# EasyEDA schematic ET_Sch_ver_1.json
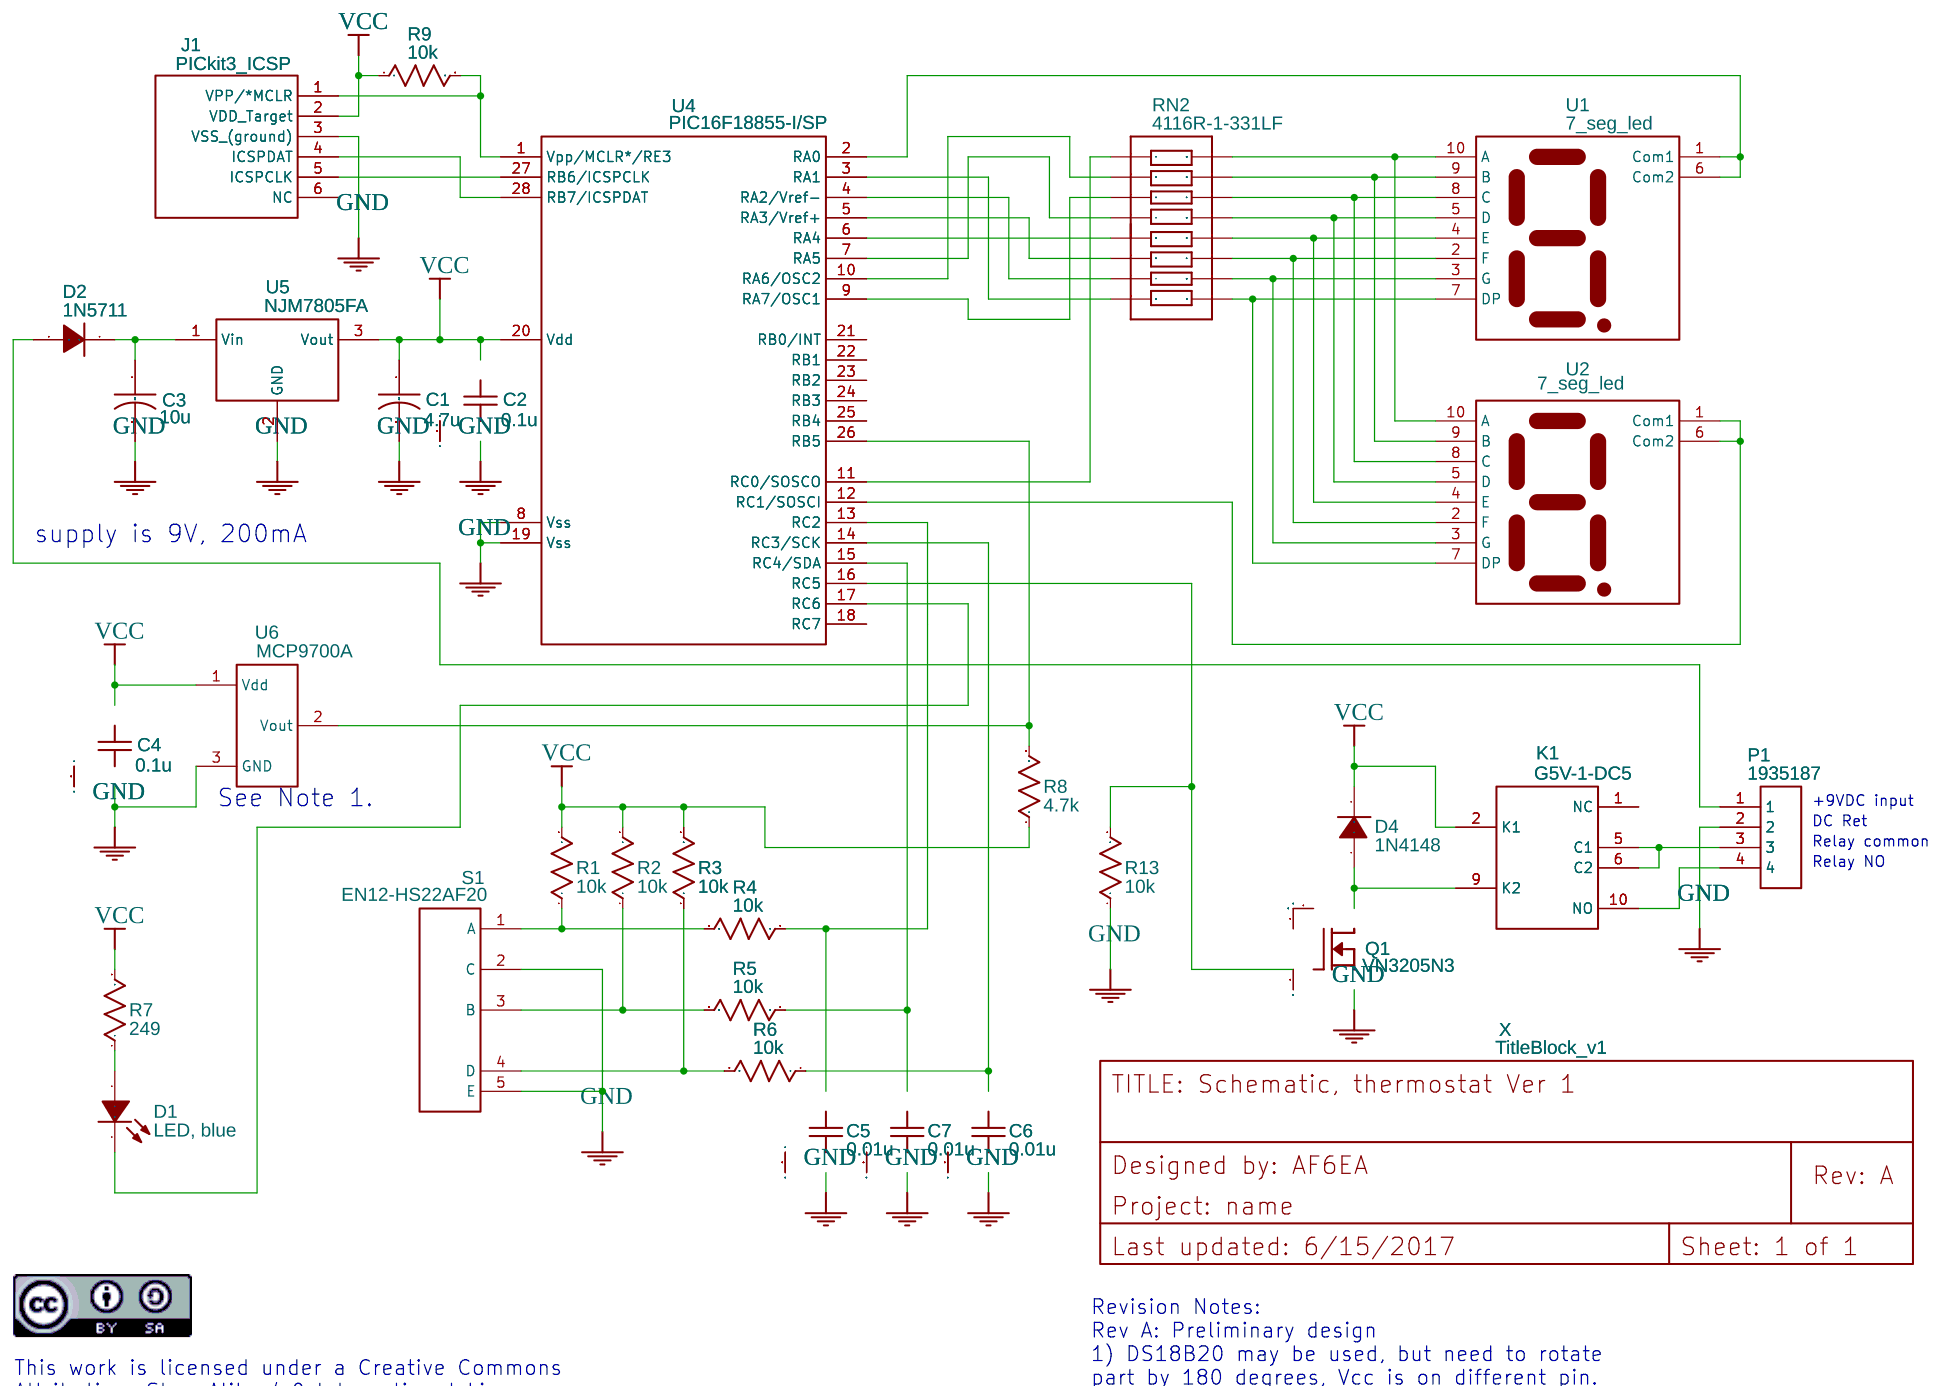
[diagram p0: schematic sheet]

## Parts
C1  4.7u  [Pan_EF_I]
C2  0.1u  [Vishay_K_15L2]
C3  10u  [Pan_EF_I]
C4  0.1u  [Vishay_K_15L2]
C5  0.01u  [Vishay_K_15L2]
C6  0.01u  [Vishay_K_15L2]
C7  0.01u  [Vishay_K_15L2]
D1  LED, blue  [5mm LED]
D2  1N5711  [DO-35]
D4  1N4148  [DO-35]
J1  PICkit3_ICSP  [6 pin header 1x6]
K1  G5V-1-DC5  [G5V-1-DC5]
P1  1935187  [1935187]
Q1  VN3205N3  [TO-92]
R1  10k  [RFN14]
R2  10k  [RFN14]
R3  10k  [RFN14]
R4  10k  [RFN14]
R5  10k  [RFN14]
R6  10k  [RFN14]
R7  249  [RFN14]
R8  4.7k  [RFN14]
R9  10k  [RFN14]
R13  10k  [RFN14]
RN2  4116R-1-331LF  [DIP16]
S1  EN12-HS22AF20  [EN12-HS22AF20]
U1  7_seg_led  [LSHD-7803]
U2  7_seg_led  [LSHD-7803]
U4  PIC16F18855-I/SP  [DIP28-300]
U5  NJM7805FA  [TO-220F3]
U6  MCP9700A  [TO-92]
X  TitleBlock_v1  [Titleblock]

## Library data of the parts
C1 C3 = Capacitor: Manufacturer Part: ?
C2 C4 = Capacitor: Manufacturer Part: K104K15X7RF5TL2; Supplier: Digi-Key; Digi-Key: BC1084CT-ND
C5-C7 = Capacitor: Manufacturer Part: K103K15X7RF5TL2; Supplier: Digi-Key; Digi-Key: BC1078CT-ND
D1 = LED: Manufacturer Part: ?
D2 = Diode: Supplier: Digi-Key; Digi-Key: 497-2499-1-ND
D4 = Diode: Supplier: Digi-Key; Digi-Key: 1N4148FS-ND
J1 U1 U2 X = -: Contributor: tcirineo
K1 = -: catid: 20; Supplier: Digi-Key; Digi-Key: Z773-ND; Manufacturer Part: ?
P1 = -: Supplier: Digi-Key; Digi-Key: 277-1579-ND; link: http://www.digikey.com/scripts/DkSearch/dksus.dll?Detail&itemSeq=215448576&uq=636190692735272026; Contributor: tcirineo
Q1 = NMOS: Manufacturer Part: VN3205N3-G; Supplier: Digi-Key; Digi-Key: VN3205N3-G-ND
R1-R6 R9 R13 = Resistor: Manufacturer Part: RNF14FTD10K0; Supplier: Digi-Key; Digi-Key: RNF14FTD10K0CT-ND
R7 = Resistor: Manufacturer Part: RNF14FTD249R; Supplier: Digi-Key; Digi-Key: RNF14FTD249RCT-ND
R8 = Resistor: Manufacturer Part: RNMF14FTC4K70; Supplier: Digi-Key; Digi-Key: S4.7KCACT-ND
RN2 = -: Supplier: Digi-Key; Digi-Key: 4116R-1-331LF-ND; link: http://www.digikey.com/scripts/DkSearch/dksus.dll?Detail&itemSeq=215068158&uq=636190722824752552; Contributor: tcirineo
S1 = -: Supplier: Digi-Key; Digi-Key: 987-1195-ND; link: http://www.digikey.com/scripts/DkSearch/dksus.dll?Detail&itemSeq=214260367&uq=636176743408872663; Contributor: tcirineo
U4 = -: Supplier: Digi-Key; Digi-Key: PIC16F18855-I/SP-ND; link: http://www.digikey.com/products/en/integrated-circuits-ics/embedded-microcontrollers/685?k=PIC16F18855&k=&pkeyword=PIC16F18855&pv1291=6302&FV=ffe002ad&mnonly=0&newproducts=0&ColumnSort=0&page=1&stock=1&quantity=0&ptm=0&fid=0&pageSize=25; Contributor: tcirineo
U5 = -: Supplier: Digi-Key; Digi-Key: NJM7805FA-ND; link: http://www.digikey.com/scripts/DkSearch/dksus.dll?Detail&itemSeq=214515814&uq=636177599579311896; Contributor: tcirineo
U6 = -: Supplier: Digi-Key; Digi-Key: MCP9700A-E/TO-ND; link: http://www.digikey.com/scripts/DkSearch/dksus.dll?Detail&itemSeq=215360231&uq=636190714661932156; Contributor: tcirineo

## Nets
GND: C1.2 C2.1 C3.2 C4.1 C5.1 C6.1 C7.1 J1.3(VSS (ground)) P1.2 Q1.2(S) R13.1 S1.2(C) S1.5(E) U4.8(Vss) U4.19(Vss) U5.2(GND) U6.3(GND)
VCC: C1.1 C2.2 C4.2 D4.K J1.2(VDD Target) K1.2(K1) R1.2 R2.2 R3.2 R7.2 R8.1 R9.1 U4.20(Vdd) U5.3(Vout) U6.1(Vdd)
C5_2: C5.2 R4.1 U4.13(RC2)
C7_2: C7.2 R5.1 U4.15(RC4/SDA)
D1_A: D1.A R7.1
D2_A: D2.A P1.1
K1_6: K1.5(C1) K1.6(C2) P1.3
K1_9: D4.A K1.9(K2) Q1.3(D)
K1_10: K1.10(NO) P1.4
R4_2: R1.1 R4.2 S1.1(A)
R5_2: R2.1 R5.2 S1.3(B)
R6_1: C6.2 R6.1 U4.14(RC3/SCK)
R6_2: R3.1 R6.2 S1.4(D)
R8_2: R8.2 U4.26(RB5) U6.2(Vout)
R9_2: J1.1(VPP/*MCLR) R9.2 U4.1(Vpp/MCLR*/RE3)
R13_2: Q1.1(G) R13.2 U4.16(RC5)
RN2_2: RN2.2 U4.10(RA6/OSC2)
RN2_3: RN2.3 U4.9(RA7/OSC1)
RN2_5: RN2.5 U4.6(RA4)
RN2_6: RN2.6 U4.5(RA3/Vref+)
RN2_7: RN2.7 U4.4(RA2/Vref-)
RN2_8: RN2.8 U4.3(RA1)
U1_1: U1.1(Com1) U1.6(Com2) U4.2(RA0)
U2_2: RN2.11 U1.2(F) U2.2(F)
U2_3: RN2.10 U1.3(G) U2.3(G)
U2_4: RN2.12 U1.4(E) U2.4(E)
U2_5: RN2.13 U1.5(D) U2.5(D)
U2_6: U2.1(Com1) U2.6(Com2) U4.12(RC1/SOSCI)
U2_7: RN2.9 U1.7(DP) U2.7(DP)
U2_8: RN2.14 U1.8(C) U2.8(C)
U2_9: RN2.15 U1.9(B) U2.9(B)
U2_10: RN2.16 U1.10(A) U2.10(A)
U4_7: RN2.4 U4.7(RA5)
U4_11: RN2.1 U4.11(RC0/SOSCO)
U4_17: D1.K U4.17(RC6)
U4_27: J1.5(ICSPCLK) U4.27(RB6/ICSPCLK)
U4_28: J1.4(ICSPDAT) U4.28(RB7/ICSPDAT)
U5_1: C3.1 D2.K U5.1(Vin)

Not connected (* = marked no-connect by the designer): J1 6(NC); K1 1(NC); U4 18(RC7) 21(RB0/INT) 22(RB1) 23(RB2) 24(RB3) 25(RB4)

## Notes on the sheet
- supply is 9V, 200mA
- See Note 1.
- +9VDC input
- DC Ret
- Relay common
- Relay NO
- Revision Notes:
  Rev A: Preliminary design
  1) DS18B20 may be used, but need to rotate
  part by 180 degrees, Vcc is on different pin.
  Install R8 when using DS18B20.
- This work is licensed under a Creative Commons
  Attribution-ShareAlike 4.0 International License.
